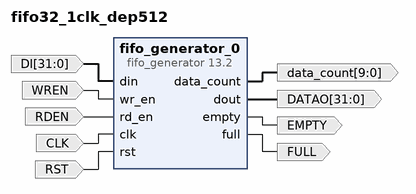
[diagram p0: block diagram of the top level]
# Vivado block design fifo32_1clk_dep512, xczu9eg-ffvb1156-2-e, Vivado 2018.3
create_bd_design fifo32_1clk_dep512

create_bd_port -dir O FULL
create_bd_port -dir I -from 31 -to 0 DI
create_bd_port -dir I WREN
create_bd_port -dir O EMPTY
create_bd_port -dir O -from 31 -to 0 DATAO
create_bd_port -dir I RDEN
create_bd_port -dir I -type clk CLK
set_property -dict {CONFIG.FREQ_HZ 100000000} [get_bd_ports CLK]
create_bd_port -dir I RST
create_bd_port -dir O -from 9 -to 0 -type data data_count

create_bd_cell -type ip -vlnv xilinx.com:ip:fifo_generator:13.2 fifo_generator_0
set_property -dict [list \
  CONFIG.Data_Count true \
  CONFIG.Data_Count_Width 10 \
  CONFIG.Enable_Safety_Circuit true \
  CONFIG.Fifo_Implementation Common_Clock_Block_RAM \
  CONFIG.Full_Flags_Reset_Value 1 \
  CONFIG.Input_Data_Width 32 \
  CONFIG.Input_Depth 512 \
  CONFIG.Performance_Options First_Word_Fall_Through \
  CONFIG.Reset_Pin true \
  CONFIG.Reset_Type Asynchronous_Reset \
  CONFIG.Use_Dout_Reset true \
  CONFIG.Use_Embedded_Registers false \
] [get_bd_cells fifo_generator_0]

# ---- connections ----

connect_bd_net [get_bd_pins fifo_generator_0/full] [get_bd_ports FULL]
connect_bd_net [get_bd_ports DI] [get_bd_pins fifo_generator_0/din]
connect_bd_net [get_bd_ports WREN] [get_bd_pins fifo_generator_0/wr_en]
connect_bd_net [get_bd_pins fifo_generator_0/empty] [get_bd_ports EMPTY]
connect_bd_net [get_bd_pins fifo_generator_0/dout] [get_bd_ports DATAO]
connect_bd_net [get_bd_ports RDEN] [get_bd_pins fifo_generator_0/rd_en]
connect_bd_net [get_bd_ports CLK] [get_bd_pins fifo_generator_0/clk]
connect_bd_net [get_bd_ports RST] [get_bd_pins fifo_generator_0/rst]
connect_bd_net [get_bd_pins fifo_generator_0/data_count] [get_bd_ports data_count]

validate_bd_design
save_bd_design
